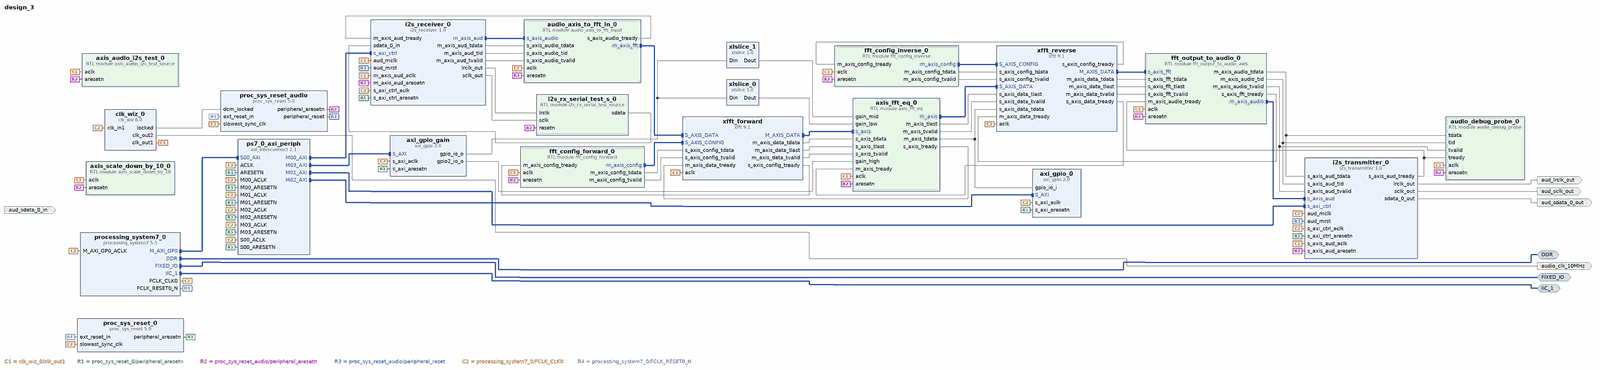
[diagram p0: block diagram of the top level, whole]
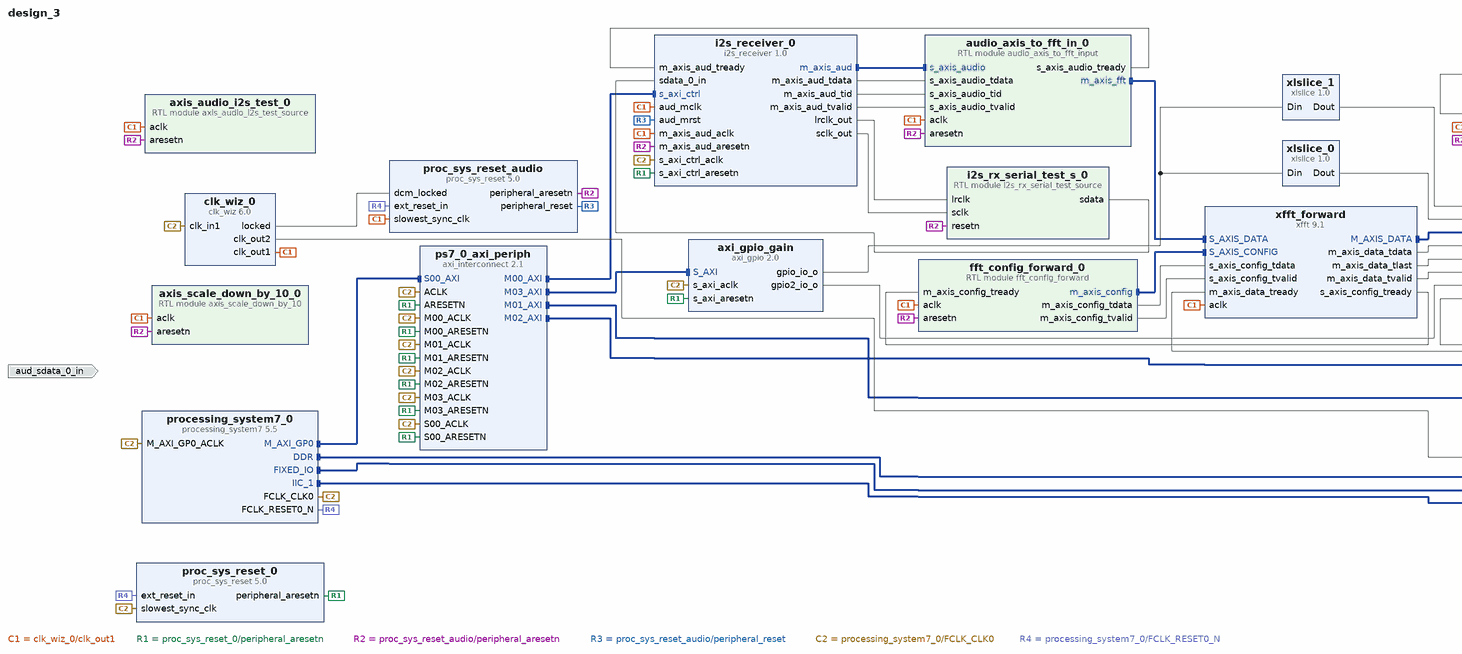
[diagram p1: block diagram of the top level, left part]
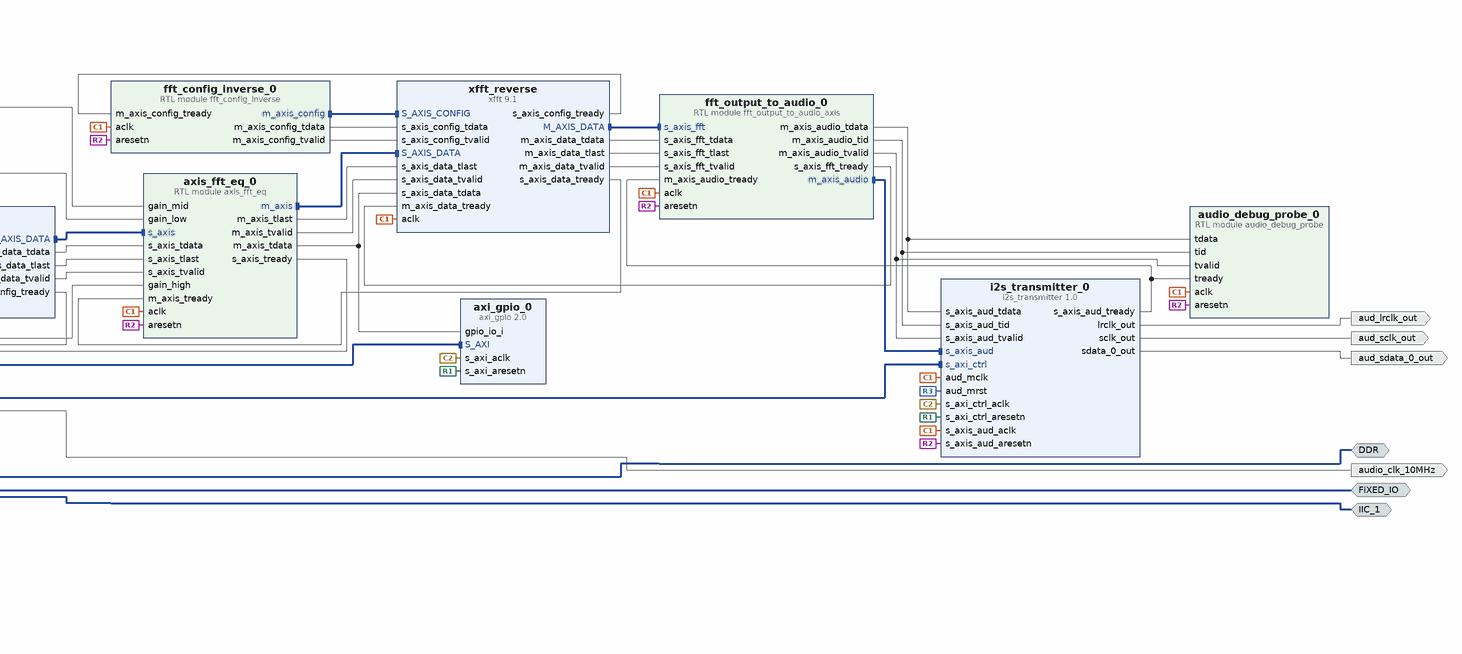
[diagram p2: block diagram of the top level, right part]
# Vivado block design design_3, xc7z020clg400-1, Vivado 2024.1
create_bd_design design_3

create_bd_intf_port -mode Master -vlnv xilinx.com:interface:ddrx_rtl:1.0 DDR
create_bd_intf_port -mode Master -vlnv xilinx.com:display_processing_system7:fixedio_rtl:1.0 FIXED_IO
create_bd_intf_port -mode Master -vlnv xilinx.com:interface:iic_rtl:1.0 IIC_1
create_bd_port -dir O aud_lrclk_out
create_bd_port -dir O aud_sclk_out
create_bd_port -dir I aud_sdata_0_in
create_bd_port -dir O aud_sdata_0_out
create_bd_port -dir O audio_clk_10MHz

create_bd_cell -type module -reference audio_debug_probe audio_debug_probe_0
create_bd_cell -type ip -vlnv xilinx.com:ip:axi_gpio:2.0 axi_gpio_0
set_property -dict {CONFIG.C_ALL_INPUTS 1 CONFIG.C_IS_DUAL 0} [get_bd_cells axi_gpio_0]
create_bd_cell -type module -reference axis_audio_i2s_test_source axis_audio_i2s_test_0
create_bd_cell -type ip -vlnv xilinx.com:ip:clk_wiz:6.0 clk_wiz_0
set_property -dict [list \
  CONFIG.CLKIN1_JITTER_PS 200.0 \
  CONFIG.CLKOUT1_DRIVES BUFG \
  CONFIG.CLKOUT1_JITTER 274.626 \
  CONFIG.CLKOUT1_PHASE_ERROR 164.985 \
  CONFIG.CLKOUT1_REQUESTED_DUTY_CYCLE 50.0 \
  CONFIG.CLKOUT1_REQUESTED_OUT_FREQ 12.288 \
  CONFIG.CLKOUT2_DRIVES BUFG \
  CONFIG.CLKOUT2_JITTER 285.743 \
  CONFIG.CLKOUT2_PHASE_ERROR 164.985 \
  CONFIG.CLKOUT2_REQUESTED_DUTY_CYCLE 50.0 \
  CONFIG.CLKOUT2_REQUESTED_OUT_FREQ 10.000 \
  CONFIG.CLKOUT2_USED true \
  CONFIG.CLKOUT3_DRIVES BUFG \
  CONFIG.CLKOUT3_JITTER 283.371 \
  CONFIG.CLKOUT3_PHASE_ERROR 856.743 \
  CONFIG.CLKOUT3_REQUESTED_DUTY_CYCLE 50.000 \
  CONFIG.CLKOUT3_USED false \
  CONFIG.CLKOUT4_DRIVES BUFG \
  CONFIG.CLKOUT4_JITTER 283.371 \
  CONFIG.CLKOUT4_PHASE_ERROR 856.743 \
  CONFIG.CLKOUT4_REQUESTED_DUTY_CYCLE 50.000 \
  CONFIG.CLKOUT4_USED false \
  CONFIG.CLKOUT5_DRIVES BUFG \
  CONFIG.CLKOUT6_DRIVES BUFG \
  CONFIG.CLKOUT7_DRIVES BUFG \
  CONFIG.ENABLE_CLOCK_MONITOR false \
  CONFIG.FEEDBACK_SOURCE FDBK_AUTO \
  CONFIG.MMCM_BANDWIDTH OPTIMIZED \
  CONFIG.MMCM_CLKFBOUT_MULT_F 20.000 \
  CONFIG.MMCM_CLKIN1_PERIOD 20.000 \
  CONFIG.MMCM_CLKIN2_PERIOD 10.0 \
  CONFIG.MMCM_CLKOUT0_DIVIDE_F 81.375 \
  CONFIG.MMCM_CLKOUT1_DIVIDE 100 \
  CONFIG.MMCM_CLKOUT2_DIVIDE 1 \
  CONFIG.MMCM_CLKOUT3_DIVIDE 1 \
  CONFIG.MMCM_COMPENSATION ZHOLD \
  CONFIG.MMCM_DIVCLK_DIVIDE 1 \
  CONFIG.NUM_OUT_CLKS 2 \
  CONFIG.PRIMITIVE MMCM \
  CONFIG.PRIM_IN_FREQ 50.000 \
  CONFIG.SS_MOD_FREQ 48 \
  CONFIG.USE_RESET false \
  CONFIG.USE_SPREAD_SPECTRUM false \
] [get_bd_cells clk_wiz_0]
create_bd_cell -type ip -vlnv xilinx.com:ip:i2s_receiver:1.0 i2s_receiver_0
create_bd_cell -type module -reference i2s_rx_serial_test_source i2s_rx_serial_test_s_0
create_bd_cell -type ip -vlnv xilinx.com:ip:i2s_transmitter:1.0 i2s_transmitter_0
create_bd_cell -type ip -vlnv xilinx.com:ip:proc_sys_reset:5.0 proc_sys_reset_0
create_bd_cell -type ip -vlnv xilinx.com:ip:proc_sys_reset:5.0 proc_sys_reset_audio
create_bd_cell -type ip -vlnv xilinx.com:ip:processing_system7:5.5 processing_system7_0
set_property -dict [list \
  CONFIG.PCW_APU_PERIPHERAL_FREQMHZ 666.666666 \
  CONFIG.PCW_ENET0_PERIPHERAL_ENABLE 0 \
  CONFIG.PCW_FPGA0_PERIPHERAL_FREQMHZ 50 \
  CONFIG.PCW_FPGA1_PERIPHERAL_FREQMHZ 50 \
  CONFIG.PCW_GPIO_MIO_GPIO_ENABLE 0 \
  CONFIG.PCW_I2C0_GRP_INT_ENABLE 0 \
  CONFIG.PCW_I2C0_I2C0_IO {MIO 10 .. 11} \
  CONFIG.PCW_I2C0_PERIPHERAL_ENABLE 1 \
  CONFIG.PCW_I2C1_I2C1_IO EMIO \
  CONFIG.PCW_I2C1_PERIPHERAL_ENABLE 1 \
  CONFIG.PCW_I2C_PERIPHERAL_FREQMHZ 111.111115 \
  CONFIG.PCW_PERIPHERAL_BOARD_PRESET None \
  CONFIG.PCW_PRESET_BANK1_VOLTAGE {LVCMOS 3.3V} \
  CONFIG.PCW_QSPI_PERIPHERAL_ENABLE 0 \
  CONFIG.PCW_SD0_PERIPHERAL_ENABLE 0 \
  CONFIG.PCW_UART1_PERIPHERAL_ENABLE 0 \
  CONFIG.PCW_UIPARAM_DDR_FREQ_MHZ 533.333333 \
  CONFIG.PCW_UIPARAM_DDR_PARTNO {MT41J128M8 JP-125} \
  CONFIG.PCW_USB0_PERIPHERAL_ENABLE 0 \
] [get_bd_cells processing_system7_0]
# 337 more settings of processing_system7_0 are not shown: defaults, MIO pin electricals, DDR timing, and values the tool derives
create_bd_cell -type ip -vlnv xilinx.com:ip:axi_interconnect:2.1 ps7_0_axi_periph
set_property -dict {CONFIG.NUM_MI 4} [get_bd_cells ps7_0_axi_periph]
create_bd_cell -type module -reference audio_axis_to_fft_input audio_axis_to_fft_in_0
create_bd_cell -type module -reference fft_output_to_audio_axis fft_output_to_audio_0
create_bd_cell -type ip -vlnv xilinx.com:ip:xfft:9.1 xfft_reverse
set_property -dict [list \
  CONFIG.implementation_options pipelined_streaming_io \
  CONFIG.number_of_stages_using_block_ram_for_data_and_phase_factors 3 \
  CONFIG.output_ordering natural_order \
] [get_bd_cells xfft_reverse]
create_bd_cell -type ip -vlnv xilinx.com:ip:xfft:9.1 xfft_forward
set_property -dict [list \
  CONFIG.implementation_options pipelined_streaming_io \
  CONFIG.number_of_stages_using_block_ram_for_data_and_phase_factors 3 \
  CONFIG.output_ordering natural_order \
  CONFIG.run_time_configurable_transform_length false \
] [get_bd_cells xfft_forward]
create_bd_cell -type module -reference axis_fft_eq axis_fft_eq_0
create_bd_cell -type module -reference axis_scale_down_by_10 axis_scale_down_by_10_0
create_bd_cell -type ip -vlnv xilinx.com:ip:axi_gpio:2.0 axi_gpio_gain
set_property -dict [list \
  CONFIG.C_ALL_OUTPUTS 1 \
  CONFIG.C_ALL_OUTPUTS_2 1 \
  CONFIG.C_GPIO2_WIDTH 16 \
  CONFIG.C_GPIO_WIDTH 32 \
  CONFIG.C_IS_DUAL 1 \
] [get_bd_cells axi_gpio_gain]
create_bd_cell -type ip -vlnv xilinx.com:ip:xlslice:1.0 xlslice_0
set_property -dict {CONFIG.DIN_FROM 15 CONFIG.DIN_TO 0 CONFIG.DOUT_WIDTH 16} [get_bd_cells xlslice_0]
create_bd_cell -type ip -vlnv xilinx.com:ip:xlslice:1.0 xlslice_1
set_property -dict {CONFIG.DIN_FROM 31 CONFIG.DIN_TO 16 CONFIG.DOUT_WIDTH 16} [get_bd_cells xlslice_1]
create_bd_cell -type module -reference fft_config_forward fft_config_forward_0
create_bd_cell -type module -reference fft_config_inverse fft_config_inverse_0

# ---- connections ----

connect_bd_intf_net [get_bd_intf_pins xfft_forward/S_AXIS_DATA] [get_bd_intf_pins audio_axis_to_fft_in_0/m_axis_fft]
connect_bd_intf_net [get_bd_intf_pins axis_fft_eq_0/m_axis] [get_bd_intf_pins xfft_reverse/S_AXIS_DATA]
connect_bd_intf_net [get_bd_intf_pins fft_config_forward_0/m_axis_config] [get_bd_intf_pins xfft_forward/S_AXIS_CONFIG]
connect_bd_intf_net [get_bd_intf_pins fft_config_inverse_0/m_axis_config] [get_bd_intf_pins xfft_reverse/S_AXIS_CONFIG]
connect_bd_intf_net [get_bd_intf_pins fft_output_to_audio_0/m_axis_audio] [get_bd_intf_pins i2s_transmitter_0/s_axis_aud]
connect_bd_intf_net [get_bd_intf_pins i2s_receiver_0/m_axis_aud] [get_bd_intf_pins audio_axis_to_fft_in_0/s_axis_audio]
connect_bd_intf_net [get_bd_intf_ports DDR] [get_bd_intf_pins processing_system7_0/DDR]
connect_bd_intf_net [get_bd_intf_ports FIXED_IO] [get_bd_intf_pins processing_system7_0/FIXED_IO]
connect_bd_intf_net [get_bd_intf_ports IIC_1] [get_bd_intf_pins processing_system7_0/IIC_1]
connect_bd_intf_net [get_bd_intf_pins processing_system7_0/M_AXI_GP0] [get_bd_intf_pins ps7_0_axi_periph/S00_AXI]
connect_bd_intf_net [get_bd_intf_pins ps7_0_axi_periph/M00_AXI] [get_bd_intf_pins i2s_receiver_0/s_axi_ctrl]
connect_bd_intf_net [get_bd_intf_pins ps7_0_axi_periph/M01_AXI] [get_bd_intf_pins i2s_transmitter_0/s_axi_ctrl]
connect_bd_intf_net [get_bd_intf_pins ps7_0_axi_periph/M02_AXI] [get_bd_intf_pins axi_gpio_0/S_AXI]
connect_bd_intf_net [get_bd_intf_pins ps7_0_axi_periph/M03_AXI] [get_bd_intf_pins axi_gpio_gain/S_AXI]
connect_bd_intf_net [get_bd_intf_pins xfft_forward/M_AXIS_DATA] [get_bd_intf_pins axis_fft_eq_0/s_axis]
connect_bd_intf_net [get_bd_intf_pins xfft_reverse/M_AXIS_DATA] [get_bd_intf_pins fft_output_to_audio_0/s_axis_fft]
connect_bd_net [get_bd_pins audio_axis_to_fft_in_0/s_axis_audio_tready] [get_bd_pins i2s_receiver_0/m_axis_aud_tready]
connect_bd_net [get_bd_pins axi_gpio_gain/gpio2_io_o] [get_bd_pins axis_fft_eq_0/gain_high]
connect_bd_net [get_bd_pins axi_gpio_gain/gpio_io_o] [get_bd_pins xlslice_0/Din] [get_bd_pins xlslice_1/Din]
connect_bd_net [get_bd_pins axis_fft_eq_0/m_axis_tdata] [get_bd_pins xfft_reverse/s_axis_data_tdata] [get_bd_pins axi_gpio_0/gpio_io_i]
connect_bd_net [get_bd_pins axis_fft_eq_0/m_axis_tlast] [get_bd_pins xfft_reverse/s_axis_data_tlast]
connect_bd_net [get_bd_pins axis_fft_eq_0/m_axis_tvalid] [get_bd_pins xfft_reverse/s_axis_data_tvalid]
connect_bd_net [get_bd_pins axis_fft_eq_0/s_axis_tready] [get_bd_pins xfft_forward/m_axis_data_tready]
connect_bd_net [get_bd_pins clk_wiz_0/clk_out1] \
  [get_bd_pins i2s_transmitter_0/aud_mclk] [get_bd_pins i2s_receiver_0/aud_mclk] \
  [get_bd_pins proc_sys_reset_audio/slowest_sync_clk] [get_bd_pins i2s_transmitter_0/s_axis_aud_aclk] \
  [get_bd_pins axis_audio_i2s_test_0/aclk] [get_bd_pins audio_debug_probe_0/aclk] \
  [get_bd_pins i2s_receiver_0/m_axis_aud_aclk] [get_bd_pins audio_axis_to_fft_in_0/aclk] \
  [get_bd_pins fft_output_to_audio_0/aclk] [get_bd_pins xfft_forward/aclk] [get_bd_pins xfft_reverse/aclk] \
  [get_bd_pins axis_scale_down_by_10_0/aclk] [get_bd_pins axis_fft_eq_0/aclk] [get_bd_pins fft_config_forward_0/aclk] \
  [get_bd_pins fft_config_inverse_0/aclk]
connect_bd_net [get_bd_pins clk_wiz_0/clk_out2] [get_bd_ports audio_clk_10MHz]
connect_bd_net [get_bd_pins clk_wiz_0/locked] [get_bd_pins proc_sys_reset_audio/dcm_locked]
connect_bd_net [get_bd_pins fft_config_forward_0/m_axis_config_tdata] [get_bd_pins xfft_forward/s_axis_config_tdata]
connect_bd_net [get_bd_pins fft_config_forward_0/m_axis_config_tvalid] [get_bd_pins xfft_forward/s_axis_config_tvalid]
connect_bd_net [get_bd_pins fft_config_inverse_0/m_axis_config_tdata] [get_bd_pins xfft_reverse/s_axis_config_tdata]
connect_bd_net [get_bd_pins fft_config_inverse_0/m_axis_config_tvalid] [get_bd_pins xfft_reverse/s_axis_config_tvalid]
connect_bd_net [get_bd_pins fft_output_to_audio_0/m_axis_audio_tdata] \
  [get_bd_pins i2s_transmitter_0/s_axis_aud_tdata] [get_bd_pins audio_debug_probe_0/tdata]
connect_bd_net [get_bd_pins fft_output_to_audio_0/m_axis_audio_tid] \
  [get_bd_pins i2s_transmitter_0/s_axis_aud_tid] [get_bd_pins audio_debug_probe_0/tid]
connect_bd_net [get_bd_pins fft_output_to_audio_0/m_axis_audio_tvalid] \
  [get_bd_pins i2s_transmitter_0/s_axis_aud_tvalid] [get_bd_pins audio_debug_probe_0/tvalid]
connect_bd_net [get_bd_pins fft_output_to_audio_0/s_axis_fft_tready] [get_bd_pins xfft_reverse/m_axis_data_tready]
connect_bd_net [get_bd_pins i2s_receiver_0/lrclk_out] [get_bd_pins i2s_rx_serial_test_s_0/lrclk]
connect_bd_net [get_bd_pins i2s_receiver_0/m_axis_aud_tdata] [get_bd_pins audio_axis_to_fft_in_0/s_axis_audio_tdata]
connect_bd_net [get_bd_pins i2s_receiver_0/m_axis_aud_tid] [get_bd_pins audio_axis_to_fft_in_0/s_axis_audio_tid]
connect_bd_net [get_bd_pins i2s_receiver_0/m_axis_aud_tvalid] [get_bd_pins audio_axis_to_fft_in_0/s_axis_audio_tvalid]
connect_bd_net [get_bd_pins i2s_receiver_0/sclk_out] [get_bd_pins i2s_rx_serial_test_s_0/sclk]
connect_bd_net [get_bd_pins i2s_rx_serial_test_s_0/sdata] [get_bd_pins i2s_receiver_0/sdata_0_in]
connect_bd_net [get_bd_pins i2s_transmitter_0/lrclk_out] [get_bd_ports aud_lrclk_out]
connect_bd_net [get_bd_pins i2s_transmitter_0/s_axis_aud_tready] \
  [get_bd_pins fft_output_to_audio_0/m_axis_audio_tready] [get_bd_pins audio_debug_probe_0/tready]
connect_bd_net [get_bd_pins i2s_transmitter_0/sclk_out] [get_bd_ports aud_sclk_out]
connect_bd_net [get_bd_pins i2s_transmitter_0/sdata_0_out] [get_bd_ports aud_sdata_0_out]
connect_bd_net [get_bd_pins proc_sys_reset_0/peripheral_aresetn] \
  [get_bd_pins ps7_0_axi_periph/S00_ARESETN] [get_bd_pins i2s_receiver_0/s_axi_ctrl_aresetn] \
  [get_bd_pins ps7_0_axi_periph/M00_ARESETN] [get_bd_pins ps7_0_axi_periph/ARESETN] \
  [get_bd_pins ps7_0_axi_periph/M01_ARESETN] [get_bd_pins ps7_0_axi_periph/M02_ARESETN] \
  [get_bd_pins axi_gpio_0/s_axi_aresetn] [get_bd_pins i2s_transmitter_0/s_axi_ctrl_aresetn] \
  [get_bd_pins axi_gpio_gain/s_axi_aresetn] [get_bd_pins ps7_0_axi_periph/M03_ARESETN]
connect_bd_net [get_bd_pins proc_sys_reset_audio/peripheral_aresetn] \
  [get_bd_pins i2s_transmitter_0/s_axis_aud_aresetn] [get_bd_pins axis_audio_i2s_test_0/aresetn] \
  [get_bd_pins audio_debug_probe_0/aresetn] [get_bd_pins i2s_receiver_0/m_axis_aud_aresetn] \
  [get_bd_pins i2s_rx_serial_test_s_0/resetn] [get_bd_pins fft_output_to_audio_0/aresetn] \
  [get_bd_pins audio_axis_to_fft_in_0/aresetn] [get_bd_pins axis_scale_down_by_10_0/aresetn] \
  [get_bd_pins axis_fft_eq_0/aresetn] [get_bd_pins fft_config_forward_0/aresetn] [get_bd_pins fft_config_inverse_0/aresetn]
connect_bd_net [get_bd_pins proc_sys_reset_audio/peripheral_reset] [get_bd_pins i2s_transmitter_0/aud_mrst] [get_bd_pins i2s_receiver_0/aud_mrst]
connect_bd_net [get_bd_pins processing_system7_0/FCLK_CLK0] \
  [get_bd_pins proc_sys_reset_0/slowest_sync_clk] [get_bd_pins processing_system7_0/M_AXI_GP0_ACLK] \
  [get_bd_pins ps7_0_axi_periph/S00_ACLK] [get_bd_pins i2s_receiver_0/s_axi_ctrl_aclk] \
  [get_bd_pins ps7_0_axi_periph/M00_ACLK] [get_bd_pins ps7_0_axi_periph/ACLK] [get_bd_pins i2s_transmitter_0/s_axi_ctrl_aclk] \
  [get_bd_pins ps7_0_axi_periph/M01_ACLK] [get_bd_pins clk_wiz_0/clk_in1] [get_bd_pins ps7_0_axi_periph/M02_ACLK] \
  [get_bd_pins axi_gpio_0/s_axi_aclk] [get_bd_pins ps7_0_axi_periph/M03_ACLK] [get_bd_pins axi_gpio_gain/s_axi_aclk]
connect_bd_net [get_bd_pins processing_system7_0/FCLK_RESET0_N] \
  [get_bd_pins proc_sys_reset_0/ext_reset_in] [get_bd_pins proc_sys_reset_audio/ext_reset_in]
connect_bd_net [get_bd_pins xfft_forward/m_axis_data_tdata] [get_bd_pins axis_fft_eq_0/s_axis_tdata]
connect_bd_net [get_bd_pins xfft_forward/m_axis_data_tlast] [get_bd_pins axis_fft_eq_0/s_axis_tlast]
connect_bd_net [get_bd_pins xfft_forward/m_axis_data_tvalid] [get_bd_pins axis_fft_eq_0/s_axis_tvalid]
connect_bd_net [get_bd_pins xfft_forward/s_axis_config_tready] [get_bd_pins fft_config_forward_0/m_axis_config_tready]
connect_bd_net [get_bd_pins xfft_reverse/m_axis_data_tdata] [get_bd_pins fft_output_to_audio_0/s_axis_fft_tdata]
connect_bd_net [get_bd_pins xfft_reverse/m_axis_data_tlast] [get_bd_pins fft_output_to_audio_0/s_axis_fft_tlast]
connect_bd_net [get_bd_pins xfft_reverse/m_axis_data_tvalid] [get_bd_pins fft_output_to_audio_0/s_axis_fft_tvalid]
connect_bd_net [get_bd_pins xfft_reverse/s_axis_config_tready] [get_bd_pins fft_config_inverse_0/m_axis_config_tready]
connect_bd_net [get_bd_pins xfft_reverse/s_axis_data_tready] [get_bd_pins axis_fft_eq_0/m_axis_tready]
connect_bd_net [get_bd_pins xlslice_0/Dout] [get_bd_pins axis_fft_eq_0/gain_low]
connect_bd_net [get_bd_pins xlslice_1/Dout] [get_bd_pins axis_fft_eq_0/gain_mid]

# ---- address map ----
assign_bd_address -offset 0x41200000 -range 64K -target_address_space [get_bd_addr_spaces processing_system7_0/Data] [get_bd_addr_segs axi_gpio_0/S_AXI/Reg]
assign_bd_address -offset 0x41210000 -range 64K -target_address_space [get_bd_addr_spaces processing_system7_0/Data] [get_bd_addr_segs axi_gpio_gain/S_AXI/Reg]
assign_bd_address -offset 0x43C00000 -range 64K -target_address_space [get_bd_addr_spaces processing_system7_0/Data] [get_bd_addr_segs i2s_receiver_0/s_axi_ctrl/Reg]
assign_bd_address -offset 0x43C10000 -range 64K -target_address_space [get_bd_addr_spaces processing_system7_0/Data] [get_bd_addr_segs i2s_transmitter_0/s_axi_ctrl/Reg]

validate_bd_design
save_bd_design
